# EAGLE schematic CorruptCore (EAGLE 8.2.1)
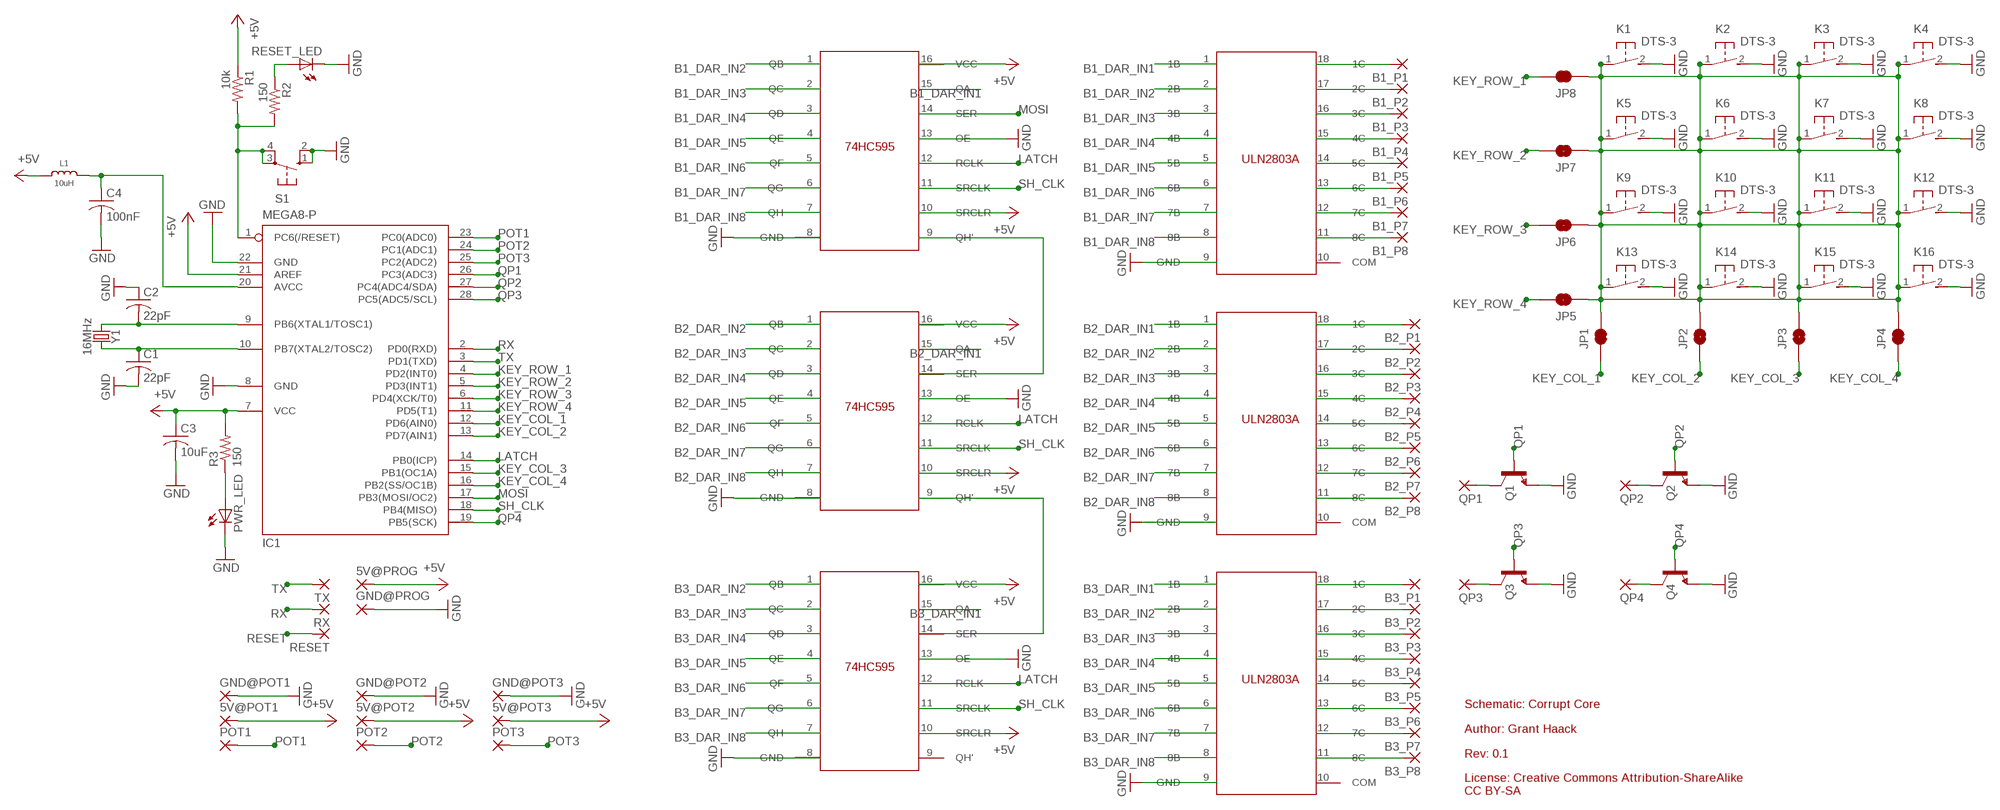
[diagram p0: schematic, sheet 1]

## Parts
5V@POT1  2,54/1,1  [2,54/1,1]
5V@POT2  2,54/1,1  [2,54/1,1]
5V@POT3  2,54/1,1  [2,54/1,1]
5V@PROG  2,54/1,1  [2,54/1,1]
B1_P1  2,54/1,1  [2,54/1,1]
B1_P2  2,54/1,1  [2,54/1,1]
B1_P3  2,54/1,1  [2,54/1,1]
B1_P4  2,54/1,1  [2,54/1,1]
B1_P5  2,54/1,1  [2,54/1,1]
B1_P6  2,54/1,1  [2,54/1,1]
B1_P7  2,54/1,1  [2,54/1,1]
B1_P8  2,54/1,1  [2,54/1,1]
B2_P1  2,54/1,1  [2,54/1,1]
B2_P2  2,54/1,1  [2,54/1,1]
B2_P3  2,54/1,1  [2,54/1,1]
B2_P4  2,54/1,1  [2,54/1,1]
B2_P5  2,54/1,1  [2,54/1,1]
B2_P6  2,54/1,1  [2,54/1,1]
B2_P7  2,54/1,1  [2,54/1,1]
B2_P8  2,54/1,1  [2,54/1,1]
B3_P1  2,54/1,1  [2,54/1,1]
B3_P2  2,54/1,1  [2,54/1,1]
B3_P3  2,54/1,1  [2,54/1,1]
B3_P4  2,54/1,1  [2,54/1,1]
B3_P5  2,54/1,1  [2,54/1,1]
B3_P6  2,54/1,1  [2,54/1,1]
B3_P7  2,54/1,1  [2,54/1,1]
B3_P8  2,54/1,1  [2,54/1,1]
C1  22pF  C-USC0805  [C0805]
C2  22pF  C-USC0805  [C0805]
C3  10uF  C-USC0805  [C0805]
C4  100nF  C-USC0805  [C0805]
GND@POT1  2,54/1,1  [2,54/1,1]
GND@POT2  2,54/1,1  [2,54/1,1]
GND@POT3  2,54/1,1  [2,54/1,1]
GND@PROG  2,54/1,1  [2,54/1,1]
IC1  MEGA8-P  [DIL28-3]
JP1  JUMPER-SMT_2_NC_TRACE_NO-SILK  [SMT-JUMPER_2_NC_TRACE_NO-SILK]
JP2  JUMPER-SMT_2_NC_TRACE_NO-SILK  [SMT-JUMPER_2_NC_TRACE_NO-SILK]
JP3  JUMPER-SMT_2_NC_TRACE_NO-SILK  [SMT-JUMPER_2_NC_TRACE_NO-SILK]
JP4  JUMPER-SMT_2_NC_TRACE_NO-SILK  [SMT-JUMPER_2_NC_TRACE_NO-SILK]
JP5  JUMPER-SMT_2_NC_TRACE_NO-SILK  [SMT-JUMPER_2_NC_TRACE_NO-SILK]
JP6  JUMPER-SMT_2_NC_TRACE_NO-SILK  [SMT-JUMPER_2_NC_TRACE_NO-SILK]
JP7  JUMPER-SMT_2_NC_TRACE_NO-SILK  [SMT-JUMPER_2_NC_TRACE_NO-SILK]
JP8  JUMPER-SMT_2_NC_TRACE_NO-SILK  [SMT-JUMPER_2_NC_TRACE_NO-SILK]
K1  DTS-3  [DTS-3]
K2  DTS-3  [DTS-3]
K3  DTS-3  [DTS-3]
K4  DTS-3  [DTS-3]
K5  DTS-3  [DTS-3]
K6  DTS-3  [DTS-3]
K7  DTS-3  [DTS-3]
K8  DTS-3  [DTS-3]
K9  DTS-3  [DTS-3]
K10  DTS-3  [DTS-3]
K11  DTS-3  [DTS-3]
K12  DTS-3  [DTS-3]
K13  DTS-3  [DTS-3]
K14  DTS-3  [DTS-3]
K15  DTS-3  [DTS-3]
K16  DTS-3  [DTS-3]
L1  10uH  MICROBUILDER_INDUCTOR_0805  [MICROBUILDER__0805]
POT1  2,54/1,1  [2,54/1,1]
POT2  2,54/1,1  [2,54/1,1]
POT3  2,54/1,1  [2,54/1,1]
PWR_LED  LEDCHIPLED_0603  [CHIPLED_0603]
Q1  TRANS_NPN-MMBTA42  [SOT23-3]
Q2  TRANS_NPN-MMBTA42  [SOT23-3]
Q3  TRANS_NPN-MMBTA42  [SOT23-3]
Q4  TRANS_NPN-MMBTA42  [SOT23-3]
QP1  2,54/1,1  [2,54/1,1]
QP2  2,54/1,1  [2,54/1,1]
QP3  2,54/1,1  [2,54/1,1]
QP4  2,54/1,1  [2,54/1,1]
R1  10k  R-US_R0805  [R0805]
R2  150  R-US_R0805  [R0805]
R3  150  R-US_R0805  [R0805]
RESET  2,54/1,1  [2,54/1,1]
RESET_LED  LEDCHIPLED_0603  [CHIPLED_0603]
RX  2,54/1,1  [2,54/1,1]
S1  10-XX  [B3F-10XX]
TX  2,54/1,1  [2,54/1,1]
U$1  SN74HC595N  [DIL16]
U$2  ULN2803A  [DIL18]
U$3  SN74HC595N  [DIL16]
U$4  ULN2803A  [DIL18]
U$5  SN74HC595N  [DIL16]
U$6  ULN2803A  [DIL18]
Y1  16MHz  CRYSTAL-16MHZPTH-HC49US  [HC49US]

## Nets
+5V: 5V@POT1.1(P) 5V@POT2.1(P) 5V@POT3.1(P) 5V@PROG.1(P) C3.1 IC1.7(VCC) IC1.21(AREF) L1.1 R1.1 R3.2 U$1.10(SRCLR) U$1.16(VCC) U$3.10(SRCLR) U$3.16(VCC) U$5.10(SRCLR) U$5.16(VCC)
B1_DAR_IN1: U$1.15(QA) U$2.1(1B)
B1_DAR_IN2: U$1.1(QB) U$2.2(2B)
B1_DAR_IN3: U$1.2(QC) U$2.3(3B)
B1_DAR_IN4: U$1.3(QD) U$2.4(4B)
B1_DAR_IN5: U$1.4(QE) U$2.5(5B)
B1_DAR_IN6: U$1.5(QF) U$2.6(6B)
B1_DAR_IN7: U$1.6(QG) U$2.7(7B)
B1_DAR_IN8: U$1.7(QH) U$2.8(8B)
B1_P1: B1_P1.1(P) U$2.18(1C)
B1_P2: B1_P2.1(P) U$2.17(2C)
B1_P3: B1_P3.1(P) U$2.16(3C)
B1_P4: B1_P4.1(P) U$2.15(4C)
B1_P5: B1_P5.1(P) U$2.14(5C)
B1_P6: B1_P6.1(P) U$2.13(6C)
B1_P7: B1_P7.1(P) U$2.12(7C)
B1_P8: B1_P8.1(P) U$2.11(8C)
B2_DAR_IN1: U$3.15(QA) U$4.1(1B)
B2_DAR_IN2: U$3.1(QB) U$4.2(2B)
B2_DAR_IN3: U$3.2(QC) U$4.3(3B)
B2_DAR_IN4: U$3.3(QD) U$4.4(4B)
B2_DAR_IN5: U$3.4(QE) U$4.5(5B)
B2_DAR_IN6: U$3.5(QF) U$4.6(6B)
B2_DAR_IN7: U$3.6(QG) U$4.7(7B)
B2_DAR_IN8: U$3.7(QH) U$4.8(8B)
B2_P1: B2_P1.1(P) U$4.18(1C)
B2_P2: B2_P2.1(P) U$4.17(2C)
B2_P3: B2_P3.1(P) U$4.16(3C)
B2_P4: B2_P4.1(P) U$4.15(4C)
B2_P5: B2_P5.1(P) U$4.14(5C)
B2_P6: B2_P6.1(P) U$4.13(6C)
B2_P7: B2_P7.1(P) U$4.12(7C)
B2_P8: B2_P8.1(P) U$4.11(8C)
B3_DAR_IN1: U$5.15(QA) U$6.1(1B)
B3_DAR_IN2: U$5.1(QB) U$6.2(2B)
B3_DAR_IN3: U$5.2(QC) U$6.3(3B)
B3_DAR_IN4: U$5.3(QD) U$6.4(4B)
B3_DAR_IN5: U$5.4(QE) U$6.5(5B)
B3_DAR_IN6: U$5.5(QF) U$6.6(6B)
B3_DAR_IN7: U$5.6(QG) U$6.7(7B)
B3_DAR_IN8: U$5.7(QH) U$6.8(8B)
B3_P1: B3_P1.1(P) U$6.18(1C)
B3_P2: B3_P2.1(P) U$6.17(2C)
B3_P3: B3_P3.1(P) U$6.16(3C)
B3_P4: B3_P4.1(P) U$6.15(4C)
B3_P5: B3_P5.1(P) U$6.14(5C)
B3_P6: B3_P6.1(P) U$6.13(6C)
B3_P7: B3_P7.1(P) U$6.12(7C)
B3_P8: B3_P8.1(P) U$6.11(8C)
GND: C1.2 C2.1 C3.2 C4.2 GND@POT1.1(P) GND@POT2.1(P) GND@POT3.1(P) GND@PROG.1(P) IC1.8(GND) IC1.22(GND) K1.2 K2.2 K3.2 K4.2 K5.2 K6.2 K7.2 K8.2 K9.2 K10.2 K11.2 K12.2 K13.2 K14.2 K15.2 K16.2 PWR_LED.C Q1.2(E) Q2.2(E) Q3.2(E) Q4.2(E) RESET_LED.C S1.1(S) S1.2(S1) U$1.8(GND) U$1.13(OE) U$2.9(GND) U$3.8(GND) U$3.13(OE) U$4.9(GND) U$5.8(GND) U$5.13(OE) U$6.9(GND)
KEY_COL_1: IC1.12(PD6(AIN0)) JP1.1
KEY_COL_2: IC1.13(PD7(AIN1)) JP2.1
KEY_COL_3: IC1.15(PB1(OC1A)) JP3.1
KEY_COL_4: IC1.16(PB2(SS/OC1B)) JP4.1
KEY_ROW_1: IC1.4(PD2(INT0)) JP8.2
KEY_ROW_2: IC1.5(PD3(INT1)) JP7.2
KEY_ROW_3: IC1.6(PD4(XCK/T0)) JP6.2
KEY_ROW_4: IC1.11(PD5(T1)) JP5.2
LATCH: IC1.14(PB0(ICP)) U$1.12(RCLK) U$3.12(RCLK) U$5.12(RCLK)
MOSI: IC1.17(PB3(MOSI/OC2)) U$1.14(SER)
N$1: U$1.9(QH') U$3.14(SER)
N$2: U$3.9(QH') U$5.14(SER)
N$3: C2.2 IC1.9(PB6(XTAL1/TOSC1)) Y1.1
N$4: C1.1 IC1.10(PB7(XTAL2/TOSC2)) Y1.2
N$5: JP1.2 JP2.2 JP3.2 JP4.2 JP5.1 JP6.1 JP7.1 JP8.1 K1.1 K2.1 K3.1 K4.1 K5.1 K6.1 K7.1 K8.1 K9.1 K10.1 K11.1 K12.1 K13.1 K14.1 K15.1 K16.1
N$6: R2.1 RESET_LED.A
N$7: PWR_LED.A R3.1
N$8: Q1.3(C) QP1.1(P)
N$9: C4.1 IC1.20(AVCC) L1.2
N$10: Q2.3(C) QP2.1(P)
N$11: Q3.3(C) QP3.1(P)
N$12: Q4.3(C) QP4.1(P)
POT1: IC1.23(PC0(ADC0)) POT1.1(P)
POT2: IC1.24(PC1(ADC1)) POT2.1(P)
POT3: IC1.25(PC2(ADC2)) POT3.1(P)
QP1: IC1.26(PC3(ADC3)) Q1.1(B)
QP2: IC1.27(PC4(ADC4/SDA)) Q2.1(B)
QP3: IC1.28(PC5(ADC5/SCL)) Q3.1(B)
QP4: IC1.19(PB5(SCK)) Q4.1(B)
RESET: IC1.1(PC6(/RESET)) R1.2 R2.2 RESET.1(P) S1.3(P) S1.4(P1)
RX: IC1.2(PD0(RXD)) RX.1(P)
SH_CLK: IC1.18(PB4(MISO)) U$1.11(SRCLK) U$3.11(SRCLK) U$5.11(SRCLK)
TX: IC1.3(PD1(TXD)) TX.1(P)
Unconnected: U$2.10(COM) U$4.10(COM) U$5.9(QH') U$6.10(COM)

## Notes on the sheet
- Schematic: Corrupt Core
- Author: Grant Haack
- Rev: 0.1
- License: Creative Commons Attribution-ShareAlike
  CC BY-SA

## Library data of the parts
5V@POT1-5V@POT3 5V@PROG B1_P1-B1_P8 B2_P1-B2_P8 B3_P1-B3_P8 GND@POT1-GND@POT3 GND@PROG POT1-POT3 QP1-QP4 RESET RX TX = wirepad:2,54/1,1: THROUGH-HOLE PAD
C1-C4 = resistor:C-US: CAPACITOR, American symbol
IC1 = atmel:MEGA8-P: MICROCONTROLLER 8 Kbytes FLASH, 1 kbytes SRAM, 512 bytes EEPROM, USART, 4-channel 10 bit ADC, 2-channel 8 bit ADC Pin compatible with Atmega48, ATMega88, ATMega168 Source: avr.lbr; OC_FARNELL: unknown; OC_NEWARK: unknown
JP1-JP8 = SparkFun-Jumpers:JUMPER-SMT_2_NC_TRACE: Normally closed trace jumper This jumper has a trace between two pads so it's normally closed (NC). Use a razor knife to open the connection. For best results follow the IPC guidelines for cutting traces: Cutout at least 0.063 mm (0.005 in). Remove all loose material to clean up the cut area. Seal the cut with an approved epoxy. Reapply solder to reclose the connection.
K1-K16 = switch-tact:DTS-3
L1 = piboy_new:MICROBUILDER_INDUCTOR: Inductors 0603: 10nH Ceramic Inductor - microwire antenna/RF (Digikey: 712-1434-2-ND) 0805: 560nH Ceramic Inductor - RF (Digikey: 553-1047-1-ND) 270nH Ceramic Inductor - Q = 40@250MHz, +-5%, 1 Ohm DC Resistance (Digikey: 535-10506-2-ND) 1007 (2518 Metric) SMT: 10µH 10% 250mOhm 820mA 1007 Inductor (Digikey: 587-2189-1-ND) 22µH 10% 500mOhm 580mA 1007 Inductor (Digikey: 587-2190-1-ND) 47µH 10% 950mOhm 420mA 1007 Inductor (Digikey: 587-2191-1-ND) 47µH 5% 100mOhm 1A 1008 Inductor (Digikey: 732-1816-1-ND) 5.0x5.0mm (Taiyo Yuden NR5040 Series) 6.8µH 20% 2.3A 64mOhm Inductor (Digikey: 587-2374-2-ND) 5.0x5.0mm (TDK VLC5045 Series) 4.7µH 20% 3.3A 34mOhm Inductor (Digikey: 445-6526-1-ND) 6.8µH 20% 2.7A 46mOhm Inductor (Digikey: 445-6527-1-ND) 6.0x6.0mm (TDK VLC6045 Series) 4.7µH 20% 3.8A 27mOhm Inductor (Digikey: 445-6538-2-ND) 6.8µH 20% 3A 41mOhm Inductor (Digikey: 445-6540-1-ND) 6.2µH 30% 2.2A 45mOhm Inductor (Digikey: SRR5028-6R2YCT-ND) - Not TDK VLC6045 but footprint should match 6.0x6.0mm (TDK SLF6045 Series) 6.8uH 30% 2A 33mOhm Inductor (Digikey: 445-4572-1-ND, Mouser: 810-SLF645T6R8N2R0PF) 6.0x6.0mm (Sumida CDRH5D28 Series) 6.2uH 30% 1.8A 45mOhm Inductor (Digikey: 308-1542-1-ND) Taiyo Yuden NR3015T2R2M - 2.2uH 20% 1.5A (Digikey: 587-1648-2-ND, Mouser: 963-NR3015T2R2M) - Used with TI TPS62172 CoilCraft RFID Transponder Coil - MA5532-AE (For use with AS3935 Lightning Sensor) Vishay IHLP 1.0uH Molded Inductor - 24mOhm DCR, 5A, +/-20%, -55°C-125°C (Digikey: 541-1319-1-ND)
PWR_LED RESET_LED = led:LED: LED OSRAM: - CHIPLED LG R971, LG N971, LY N971, LG Q971, LY Q971, LO R971, LY R971 LH N974, LH R974 LS Q976, LO Q976, LY Q976 LO Q996 - Hyper CHIPLED LW Q18S LB Q993, LB Q99A, LB R99A - SideLED LS A670, LO A670, LY A670, LG A670, LP A670 LB A673, LV A673, LT A673, LW A673 LH A674 LY A675 LS A676, LA A676, LO A676, LY A676, LW A676 LS A679, LY A679, LG A679 - Hyper Micro SIDELED® LS Y876, LA Y876, LO Y876, LY Y876 LT Y87S - SmartLED LW L88C, LW L88S LB L89C, LB L89S, LG L890 LS L89K, LO L89K, LY L89K LS L896, LA L896, LO L896, LY L896 - TOPLED LS T670, LO T670, LY T670, LG T670, LP T670 LSG T670, LSP T670, LSY T670, LOP T670, LYG T670 LG T671, LOG T671, LSG T671 LB T673, LV T673, LT T673, LW T673 LH T674 LS T676, LA T676, LO T676, LY T676, LB T676, LH T676, LSB T676, LW T676 LB T67C, LV T67C, LT T67C, LS T67K, LO T67K, LY T67K, LW E67C LS E67B, LA E67B, LO E67B, LY E67B, LB E67C, LV E67C, LT E67C LW T67C LS T679, LY T679, LG T679 LS T770, LO T770, LY T770, LG T770, LP T770 LB T773, LV T773, LT T773, LW T773 LH T774 LS E675, LA E675, LY E675, LS T675 LS T776, LA T776, LO T776, LY T776, LB T776 LHGB T686 LT T68C, LB T68C - Hyper Mini TOPLED® LB M676 - Mini TOPLED Santana® LG M470 LS M47K, LO M47K, LY M47K Source: http://www.osram.convergy.de LUXEON: - LUMILED® LXK2-PW12-R00, LXK2-PW12-S00, LXK2-PW14-U00, LXK2-PW14-V00 LXK2-PM12-R00, LXK2-PM12-S00, LXK2-PM14-U00 LXK2-PE12-Q00, LXK2-PE12-R00, LXK2-PE12-S00, LXK2-PE14-T00, LXK2-PE14-U00 LXK2-PB12-K00, LXK2-PB12-L00, LXK2-PB12-M00, LXK2-PB14-N00, LXK2-PB14-P00, LXK2-PB14-Q00 LXK2-PR12-L00, LXK2-PR12-M00, LXK2-PR14-Q00, LXK2-PR14-R00 LXK2-PD12-Q00, LXK2-PD12-R00, LXK2-PD12-S00 LXK2-PH12-R00, LXK2-PH12-S00 LXK2-PL12-P00, LXK2-PL12-Q00, LXK2-PL12-R00 Source: www.luxeon.com KINGBRIGHT: KA-3528ASYC Source: www.kingbright.com
Q1-Q4 = SparkFun-DiscreteSemi:TRANS_NPN: NPN transistor Current controlled devices typically used to amplify current or used as a switch. BC547 - COM-08928 <http://www.sparkfun.com/products/8928> (TO-92 45V 100mA) (1.Collector 2.Base 3.Emitter) 2N3904 - COM-00521 <http://www.sparkfun.com/products/521> (TO-92 40V 200mA) (1.Emitter 2.Base 3.Collector) P2N2222A - COM-12852 <http://www.sparkfun.com/products/12852> (TO-92 40V 600mA) (1.Collector 2.Base 3.Emitter); PROD_ID: TRANS-09116; VALUE: 500mA/300V
R1-R3 = resistor:R-US_: RESISTOR, American symbol
S1 = switch-omron:10-XX: OMRON SWITCH; MPN: B3F-1000; OC_FARNELL: 176432; OC_NEWARK: 36M3542
U$1 U$3 U$5 = CorruptCore:SN74HC595N
U$2 U$4 U$6 = CorruptCore:ULN2803A
Y1 = SparkFun-Clocks:CRYSTAL-16MHZ: 16MHz Crystal Digikey Example <http://www.digikey.com/product-search/en?keywords=535-9122-1-ND> Frequency: 16MHz Frequency Stability: ±50ppm Frequency Tolerance: ±20ppm Load Capacitance: 18pF SparkFun Products: Pro Micro -5V/16MHz <https://www.sparkfun.com/products/12640> SparkFun Serial Enabled LCD Kit <https://www.sparkfun.com/products/10097>; PROD_ID: XTAL-08181; SF_ID: COM-00536